# Altium schematic sheet 09_Display_Leds-2.SchDoc
size 558 x 431 mm
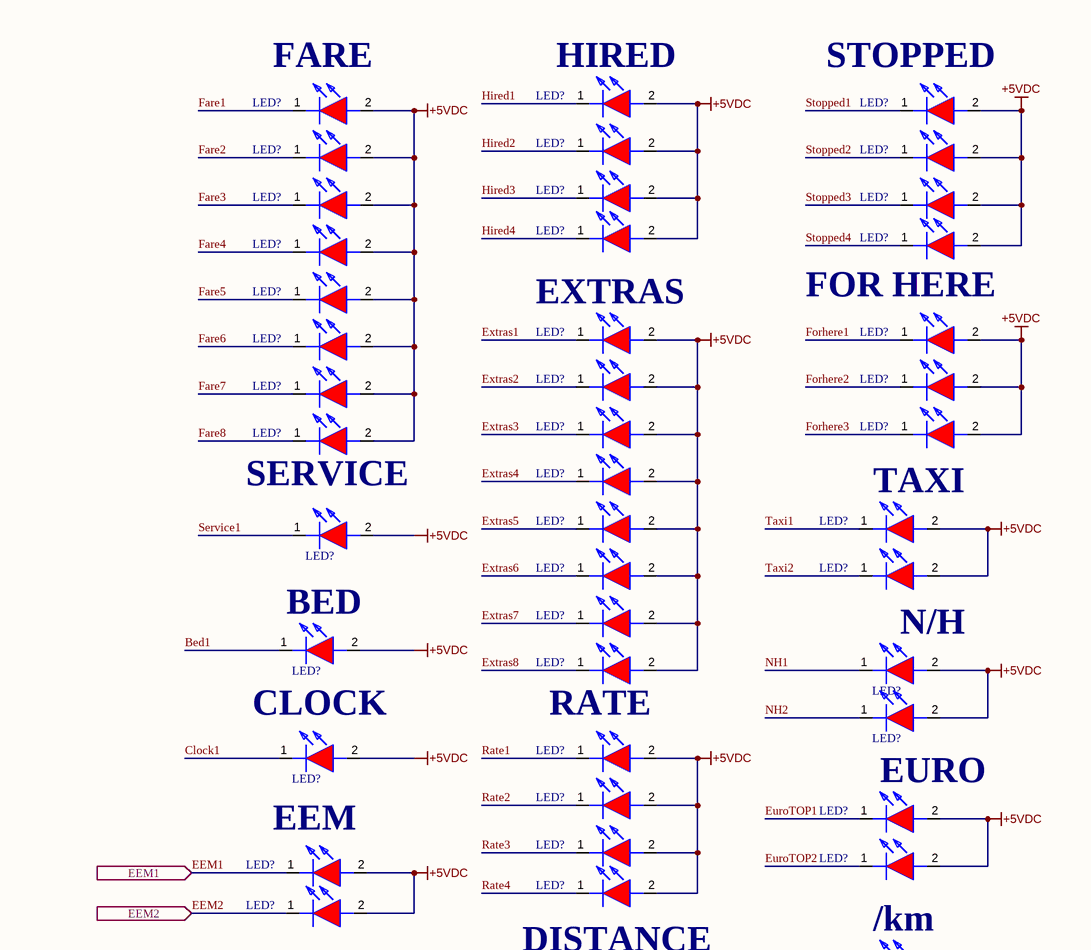
[diagram p0: 09_Display_Leds-2.SchDoc, top right]
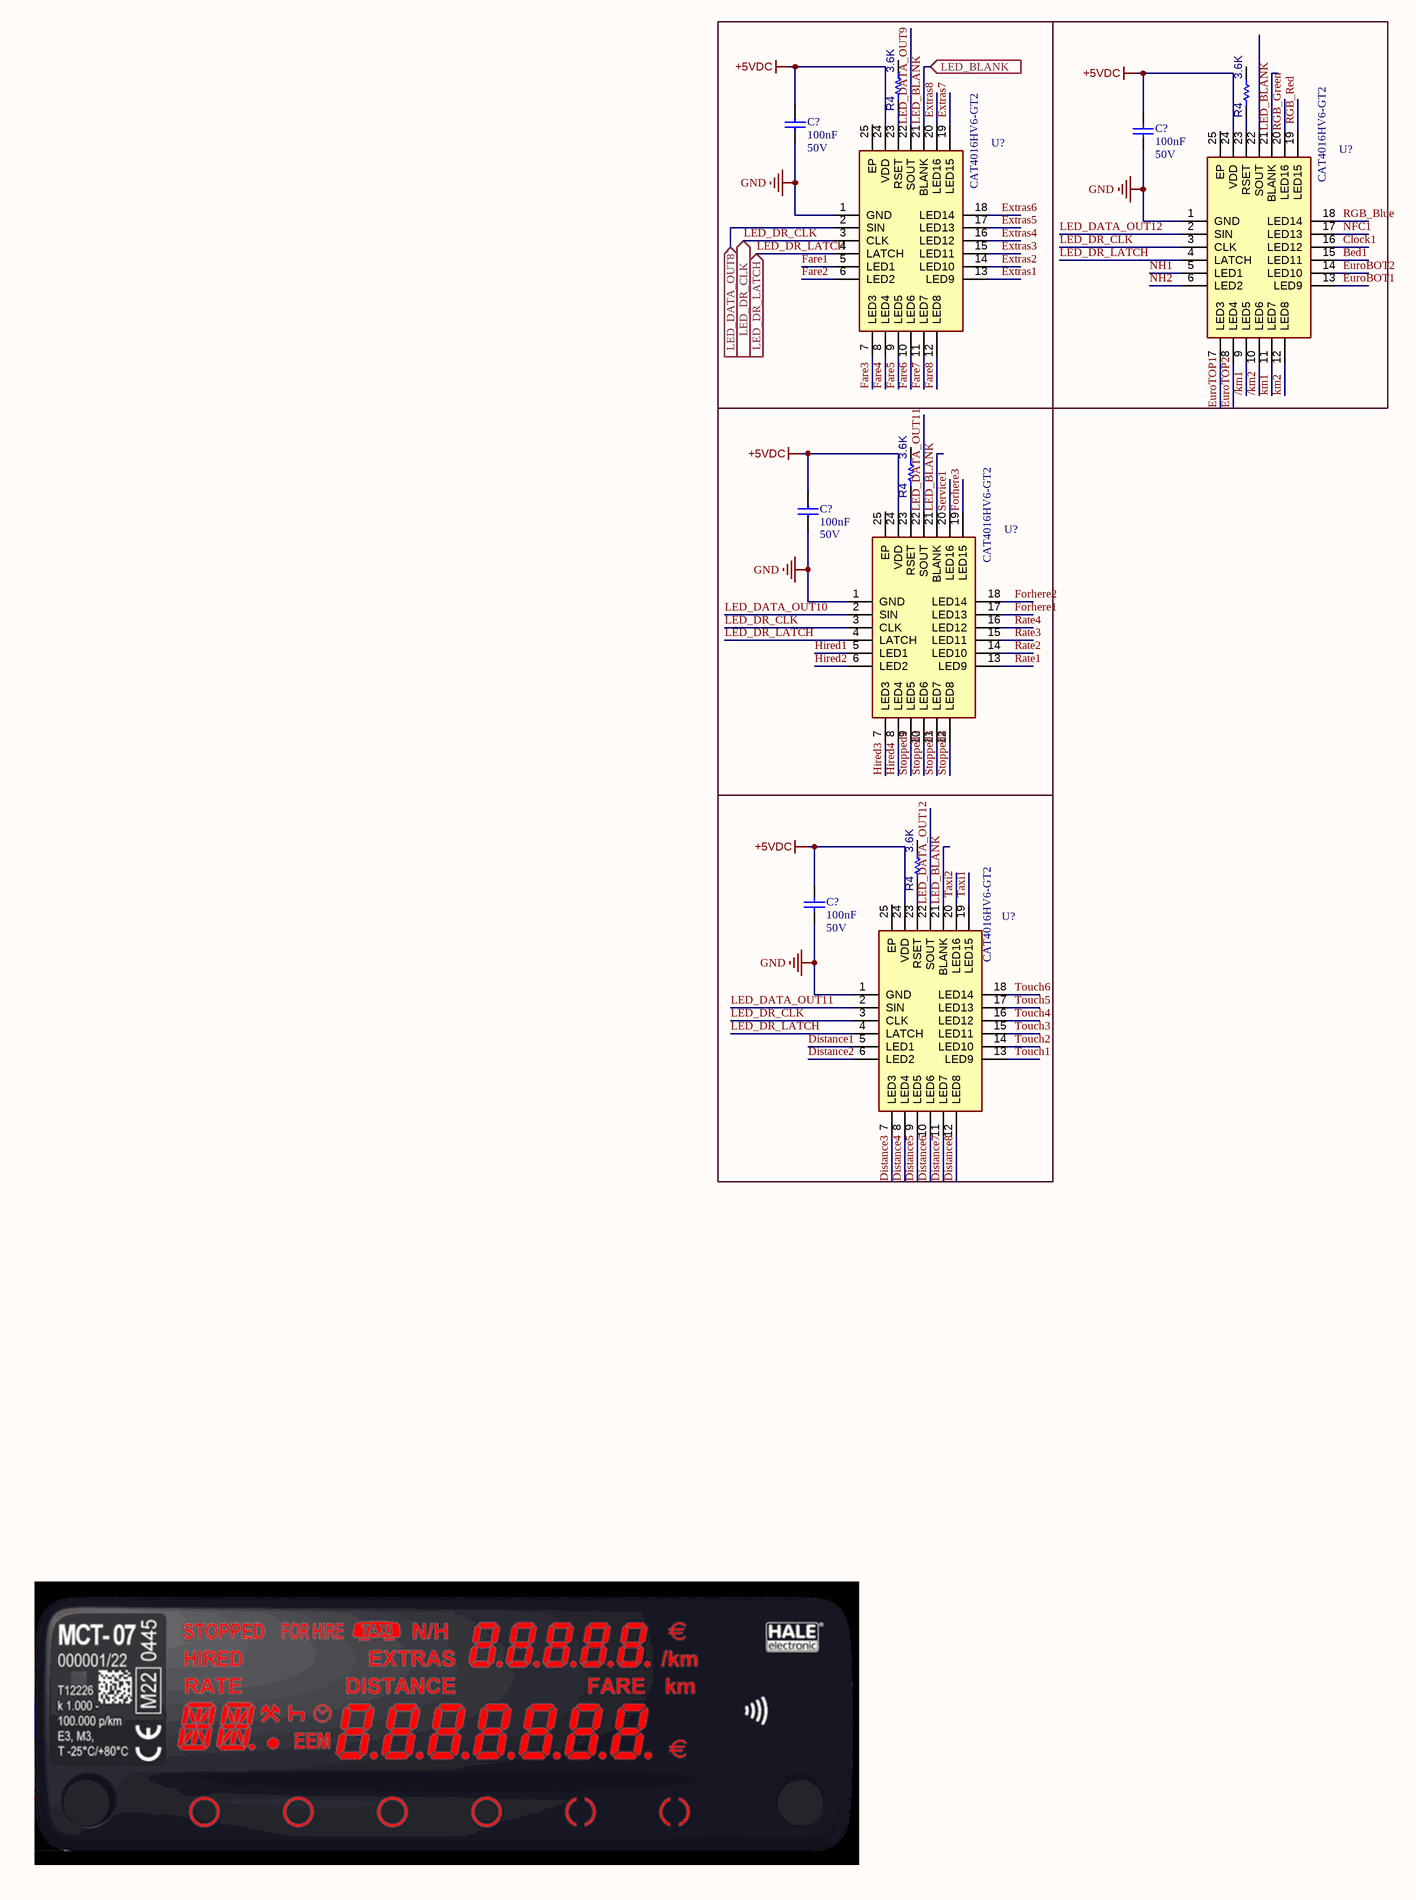
[diagram p1: 09_Display_Leds-2.SchDoc, bottom left]
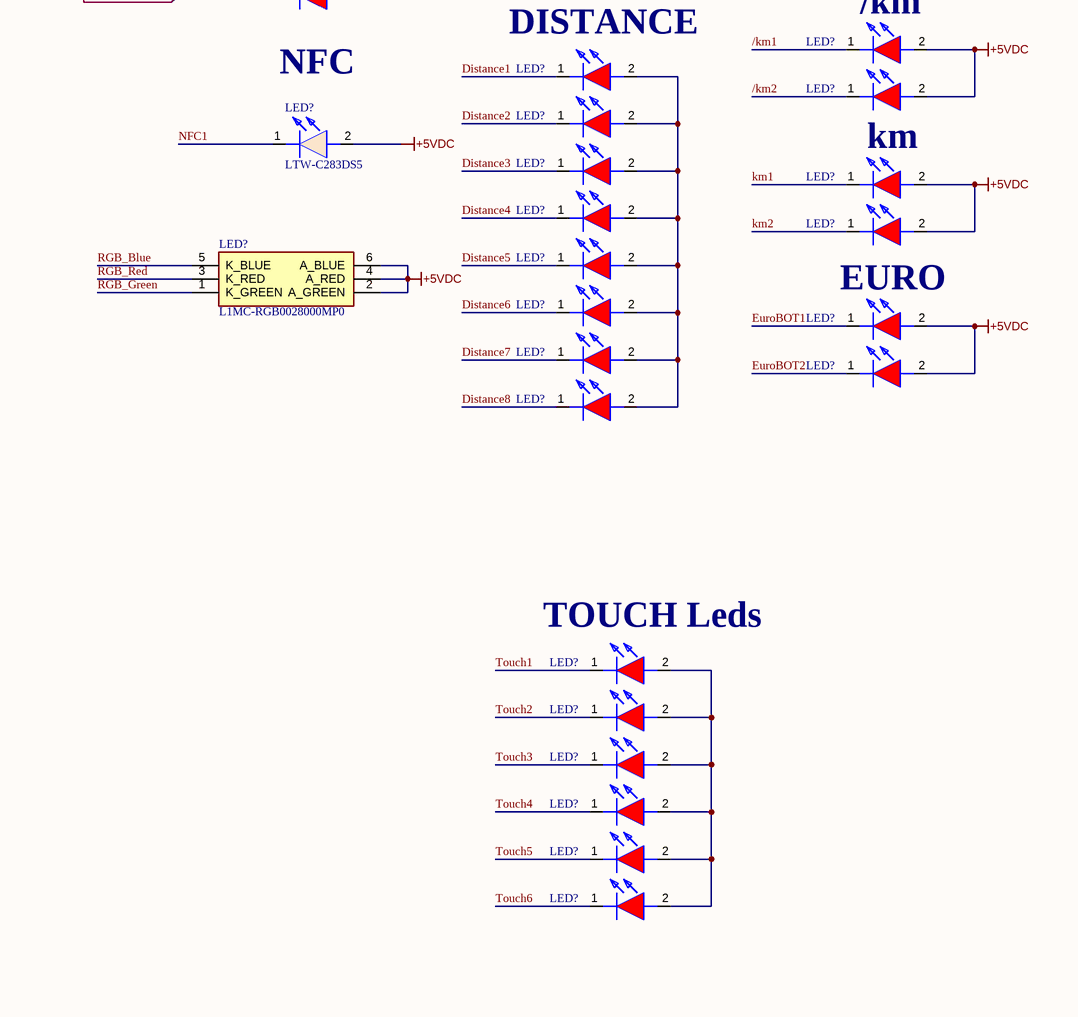
[diagram p2: 09_Display_Leds-2.SchDoc, bottom right]

## Parts
(Parts that share a designator on the sheet are numbered #1, #2 ... from top to bottom, then left to right.)
C?#1  value 100nF  Voltage: 50V  [CAP_0603]  (hidden comment: CAP)
C?#2  value 100nF  Voltage: 50V  [CAP_0603]  (hidden comment: CAP)
C?#3  value 100nF  Voltage: 50V  [CAP_0603]  (hidden comment: CAP)
C?#4  value 100nF  Voltage: 50V  [CAP_0603]  (hidden comment: CAP)
LED?#1  YLED0402R  [APHHS1005LSECKJ3PF]  (value not drawn)
LED?#2  YLED0402R  [APHHS1005LSECKJ3PF]  (value not drawn)
LED?#3  YLED0402R  [APHHS1005LSECKJ3PF]  (value not drawn)
LED?#4  YLED0402R  [APHHS1005LSECKJ3PF]  (value not drawn)
LED?#5  YLED0402R  [APHHS1005LSECKJ3PF]  (value not drawn)
LED?#6  YLED0402R  [APHHS1005LSECKJ3PF]  (value not drawn)
LED?#7  YLED0402R  [APHHS1005LSECKJ3PF]  (value not drawn)
LED?#8  YLED0402R  [APHHS1005LSECKJ3PF]  (value not drawn)
LED?#9  YLED0402R  [APHHS1005LSECKJ3PF]  (value not drawn)
LED?#10  YLED0402R  [APHHS1005LSECKJ3PF]  (value not drawn)
LED?#11  YLED0402R  [APHHS1005LSECKJ3PF]  (value not drawn)
LED?#12  YLED0402R  [APHHS1005LSECKJ3PF]  (value not drawn)
LED?#13  YLED0402R  [APHHS1005LSECKJ3PF]  (value not drawn)
LED?#14  YLED0402R  [APHHS1005LSECKJ3PF]  (value not drawn)
LED?#15  YLED0402R  [APHHS1005LSECKJ3PF]  (value not drawn)
LED?#16  YLED0402R  [APHHS1005LSECKJ3PF]  (value not drawn)
LED?#17  YLED0402R  [APHHS1005LSECKJ3PF]  (value not drawn)
LED?#18  YLED0402R  [APHHS1005LSECKJ3PF]  (value not drawn)
LED?#19  YLED0402R  [APHHS1005LSECKJ3PF]  (value not drawn)
LED?#20  YLED0402R  [APHHS1005LSECKJ3PF]  (value not drawn)
LED?#21  YLED0402R  [APHHS1005LSECKJ3PF]  (value not drawn)
LED?#22  YLED0402R  [APHHS1005LSECKJ3PF]  (value not drawn)
LED?#23  YLED0402R  [APHHS1005LSECKJ3PF]  (value not drawn)
LED?#24  YLED0402R  [APHHS1005LSECKJ3PF]  (value not drawn)
LED?#25  YLED0402R  [APHHS1005LSECKJ3PF]  (value not drawn)
LED?#26  YLED0402R  [APHHS1005LSECKJ3PF]  (value not drawn)
LED?#27  YLED0402R  [APHHS1005LSECKJ3PF]  (value not drawn)
LED?#28  YLED0402R  [APHHS1005LSECKJ3PF]  (value not drawn)
LED?#29  YLED0402R  [APHHS1005LSECKJ3PF]  (value not drawn)
LED?#30  YLED0402R  [APHHS1005LSECKJ3PF]  (value not drawn)
LED?#31  YLED0402R  [APHHS1005LSECKJ3PF]  (value not drawn)
LED?#32  YLED0402R  [APHHS1005LSECKJ3PF]  (value not drawn)
LED?#33  YLED0402R  [APHHS1005LSECKJ3PF]  (value not drawn)
LED?#34  YLED0402R  [APHHS1005LSECKJ3PF]  (value not drawn)
LED?#35  YLED0402R  [APHHS1005LSECKJ3PF]  (value not drawn)
LED?#36  YLED0402R  [APHHS1005LSECKJ3PF]  (value not drawn)
LED?#37  YLED0402R  [APHHS1005LSECKJ3PF]  (value not drawn)
LED?#38  YLED0402R  [APHHS1005LSECKJ3PF]  (value not drawn)
LED?#39  YLED0402R  [APHHS1005LSECKJ3PF]  (value not drawn)
LED?#40  YLED0402R  [APHHS1005LSECKJ3PF]  (value not drawn)
LED?#41  YLED0402R  [APHHS1005LSECKJ3PF]  (value not drawn)
LED?#42  YLED0402R  [APHHS1005LSECKJ3PF]  (value not drawn)
LED?#43  YLED0402R  [APHHS1005LSECKJ3PF]  (value not drawn)
LED?#44  YLED0402R  [APHHS1005LSECKJ3PF]  (value not drawn)
LED?#45  YLED0402R  [APHHS1005LSECKJ3PF]  (value not drawn)
LED?#46  YLED0402R  [APHHS1005LSECKJ3PF]  (value not drawn)
LED?#47  LTW-C283DS5  [APHHS1005LSECKJ3PF]
LED?#48  YLED0402R  [APHHS1005LSECKJ3PF]  (value not drawn)
LED?#49  YLED0402R  [APHHS1005LSECKJ3PF]  (value not drawn)
LED?#50  YLED0402R  [APHHS1005LSECKJ3PF]  (value not drawn)
LED?#51  YLED0402R  [APHHS1005LSECKJ3PF]  (value not drawn)
LED?#52  L1MC-RGB0028000MP0  [L1MCRGB0028000MP0]
LED?#53  YLED0402R  [APHHS1005LSECKJ3PF]  (value not drawn)
LED?#54  YLED0402R  [APHHS1005LSECKJ3PF]  (value not drawn)
LED?#55  YLED0402R  [APHHS1005LSECKJ3PF]  (value not drawn)
LED?#56  YLED0402R  [APHHS1005LSECKJ3PF]  (value not drawn)
LED?#57  YLED0402R  [APHHS1005LSECKJ3PF]  (value not drawn)
LED?#58  YLED0402R  [APHHS1005LSECKJ3PF]  (value not drawn)
LED?#59  YLED0402R  [APHHS1005LSECKJ3PF]  (value not drawn)
LED?#60  YLED0402R  [APHHS1005LSECKJ3PF]  (value not drawn)
LED?#61  YLED0402R  [APHHS1005LSECKJ3PF]  (value not drawn)
LED?#62  YLED0402R  [APHHS1005LSECKJ3PF]  (value not drawn)
LED?#63  YLED0402R  [APHHS1005LSECKJ3PF]  (value not drawn)
LED?#64  YLED0402R  [APHHS1005LSECKJ3PF]  (value not drawn)
R4#1  value 3.6K  [RES_0603]  (hidden comment: RC0603FR-133K6L)
R4#2  value 3.6K  [RES_0603]  (hidden comment: RC0603FR-133K6L)
R4#3  value 3.6K  [RES_0603]  (hidden comment: RC0603FR-133K6L)
R4#4  value 3.6K  [RES_0603]  (hidden comment: RC0603FR-133K6L)
U?#1  CAT4016HV6-GT2  [QFN50P400X400X80-25N-D]
U?#2  CAT4016HV6-GT2  [QFN50P400X400X80-25N-D]
U?#3  CAT4016HV6-GT2  [QFN50P400X400X80-25N-D]
U?#4  CAT4016HV6-GT2  [QFN50P400X400X80-25N-D]

## Ports
EEM1 (in), EEM2 (in), LED_BLANK (in), LED_DATA_OUT8 (in), LED_DR_CLK (in), LED_DR_LATCH (in)

## Nets
+5VDC: C?#1.1 C?#2.1 C?#3.1 C?#4.1 LED?#1.2(A) LED?#2.2(A) LED?#3.2(A) LED?#4.2(A) LED?#5.2(A) LED?#6.2(A) LED?#7.2(A) LED?#8.2(A) LED?#9.2(A) LED?#10.2(A) LED?#11.2(A) LED?#12.2(A) LED?#13.2(A) LED?#14.2(A) LED?#15.2(A) LED?#16.2(A) LED?#17.2(A) LED?#18.2(A) LED?#19.2(A) LED?#20.2(A) LED?#21.2(A) LED?#22.2(A) LED?#23.2(A) LED?#24.2(A) LED?#25.2(A) LED?#26.2(A) LED?#27.2(A) LED?#28.2(A) LED?#29.2(A) LED?#30.2(A) LED?#31.2(A) LED?#32.2(A) LED?#33.2(A) LED?#34.2(A) LED?#35.2(A) LED?#36.2(A) LED?#37.2(A) LED?#38.2(A) LED?#39.2(A) LED?#40.2(A) LED?#41.2(A) LED?#42.2(A) LED?#43.2(A) LED?#45.2(A) LED?#47.2(A) LED?#49.2(A) LED?#51.2(A) LED?#52.2(A_GREEN) LED?#52.4(A_RED) LED?#52.6(A_BLUE) LED?#55.2(A) LED?#57.2(A) U?#1.24(VDD) U?#2.24(VDD) U?#3.24(VDD) U?#4.24(VDD)
GND: C?#1.2 C?#2.2 C?#3.2 C?#4.2 U?#1.1(GND) U?#2.1(GND) U?#3.1(GND) U?#4.1(GND)
/km1: LED?#43.1(K) U?#2.9(LED5)
/km2: LED?#45.1(K) U?#2.10(LED6)
Bed1: LED?#30.1(K) U?#2.15(LED11)
Clock1: LED?#34.1(K) U?#2.16(LED12)
Distance1: LED?#44.1(K) U?#4.5(LED1)
Distance2: LED?#46.1(K) U?#4.6(LED2)
Distance3: LED?#48.1(K) U?#4.7(LED3)
Distance4: LED?#50.1(K) U?#4.8(LED4)
Distance5: LED?#53.1(K) U?#4.9(LED5)
Distance6: LED?#54.1(K) U?#4.10(LED6)
Distance7: LED?#56.1(K) U?#4.11(LED7)
Distance8: LED?#58.1(K) U?#4.12(LED8)
EEM1: LED?#40.1(K) ; port EEM1
EEM2: LED?#42.1(K) ; port EEM2
EuroBOT1: LED?#55.1(K) U?#2.13(LED9)
EuroBOT2: LED?#57.1(K) U?#2.14(LED10)
EuroTOP1: LED?#37.1(K) U?#2.7(LED3)
EuroTOP2: LED?#39.1(K) U?#2.8(LED4)
Extras1: LED?#14.1(K) U?#1.13(LED9)
Extras2: LED?#17.1(K) U?#1.14(LED10)
Extras3: LED?#20.1(K) U?#1.15(LED11)
Extras4: LED?#23.1(K) U?#1.16(LED12)
Extras5: LED?#24.1(K) U?#1.17(LED13)
Extras6: LED?#27.1(K) U?#1.18(LED14)
Extras7: LED?#29.1(K) U?#1.19(LED15)
Extras8: LED?#31.1(K) U?#1.20(LED16)
Fare1: LED?#2.1(K) U?#1.5(LED1)
Fare2: LED?#5.1(K) U?#1.6(LED2)
Fare3: LED?#8.1(K) U?#1.7(LED3)
Fare4: LED?#12.1(K) U?#1.8(LED4)
Fare5: LED?#13.1(K) U?#1.9(LED5)
Fare6: LED?#16.1(K) U?#1.10(LED6)
Fare7: LED?#19.1(K) U?#1.11(LED7)
Fare8: LED?#22.1(K) U?#1.12(LED8)
Forhere1: LED?#15.1(K) U?#3.17(LED13)
Forhere2: LED?#18.1(K) U?#3.18(LED14)
Forhere3: LED?#21.1(K) U?#3.19(LED15)
Hired1: LED?#1.1(K) U?#3.5(LED1)
Hired2: LED?#4.1(K) U?#3.6(LED2)
Hired3: LED?#7.1(K) U?#3.7(LED3)
Hired4: LED?#10.1(K) U?#3.8(LED4)
km1: LED?#49.1(K) U?#2.11(LED7)
km2: LED?#51.1(K) U?#2.12(LED8)
LED_BLANK: U?#1.21(BLANK) U?#2.21(BLANK) U?#3.21(BLANK) U?#4.21(BLANK) ; port LED_BLANK
LED_DATA_OUT8: U?#1.2(SIN) ; port LED_DATA_OUT8
LED_DATA_OUT9: U?#1.22(SOUT)
LED_DATA_OUT10: U?#3.2(SIN)
LED_DATA_OUT11: U?#3.22(SOUT) U?#4.2(SIN)
LED_DATA_OUT12: U?#2.2(SIN) U?#4.22(SOUT)
LED_DR_CLK: U?#1.3(CLK) U?#2.3(CLK) U?#3.3(CLK) U?#4.3(CLK) ; port LED_DR_CLK
LED_DR_LATCH: U?#1.4(LATCH) U?#2.4(LATCH) U?#3.4(LATCH) U?#4.4(LATCH) ; port LED_DR_LATCH
NFC1: LED?#47.1(K) U?#2.17(LED13)
NH1: LED?#32.1(K) U?#2.5(LED1)
NH2: LED?#33.1(K) U?#2.6(LED2)
Rate1: LED?#35.1(K) U?#3.13(LED9)
Rate2: LED?#36.1(K) U?#3.14(LED10)
Rate3: LED?#38.1(K) U?#3.15(LED11)
Rate4: LED?#41.1(K) U?#3.16(LED12)
RGB_Blue: LED?#52.5(K_BLUE) U?#2.18(LED14)
RGB_Green: LED?#52.1(K_GREEN) U?#2.20(LED16)
RGB_Red: LED?#52.3(K_RED) U?#2.19(LED15)
Service1: LED?#26.1(K) U?#3.20(LED16)
Stopped1: LED?#3.1(K) U?#3.9(LED5)
Stopped2: LED?#6.1(K) U?#3.10(LED6)
Stopped3: LED?#9.1(K) U?#3.11(LED7)
Stopped4: LED?#11.1(K) U?#3.12(LED8)
Taxi1: LED?#25.1(K) U?#4.19(LED15)
Taxi2: LED?#28.1(K) U?#4.20(LED16)
Touch1: LED?#59.1(K) U?#4.13(LED9)
Touch2: LED?#60.1(K) U?#4.14(LED10)
Touch3: LED?#61.1(K) U?#4.15(LED11)
Touch4: LED?#62.1(K) U?#4.16(LED12)
Touch5: LED?#63.1(K) U?#4.17(LED13)
Touch6: LED?#64.1(K) U?#4.18(LED14)
NetLED?#44_2: LED?#44.2(A) LED?#46.2(A) LED?#48.2(A) LED?#50.2(A) LED?#53.2(A) LED?#54.2(A) LED?#56.2(A) LED?#58.2(A)
NetLED?#59_2: LED?#59.2(A) LED?#60.2(A) LED?#61.2(A) LED?#62.2(A) LED?#63.2(A) LED?#64.2(A)
NetR4#1_1: R4#1.1 U?#1.23(RSET)
NetR4#2_1: R4#2.1 U?#2.23(RSET)
NetR4#3_1: R4#3.1 U?#3.23(RSET)
NetR4#4_1: R4#4.1 U?#4.23(RSET)

Not connected (* = marked no-connect by the designer): R4#1 2; R4#2 2; R4#3 2; R4#4 2; U?#1 25(EP); U?#2 22(SOUT) 25(EP); U?#3 25(EP); U?#4 25(EP)

## Notes on the sheet
- (near LED?#2) FARE
- (near LED?#1) HIRED
- (near LED?#3) STOPPED
- (near LED?#14) EXTRAS
- (near LED?#11) FOR HERE
- (near LED?#22) SERVICE
- (near LED?#21) TAXI
- (near LED?#30) BED
- (near LED?#28) N/H
- (near LED?#30) CLOCK
- (near LED?#31) RATE
- (near LED?#37) EURO
- (near LED?#40) EEM
- (near LED?#42) NFC
- (near LED?#41) DISTANCE
- (near LED?#43) /km
- (near LED?#45) km
- (near LED?#51) EURO
- (near LED?#59) TOUCH Leds
- DWG. NO.
- REV.
- SHT.
- REVISION
- DESCRIPTION
- DATE
- APPROVED
- THIS DOCUMENT AND THE DATA DISCLOSED HEREIN OR HEREWITH IS THE PROPERTY OF ALTIUM LIMITED AND MAY BE FREELY DISTRIBUTED IN WHOLE. NO RIGHTS ARE RESERVED OR EXPRESS OR IMPLIED WARANTEE GIVEN.
- ENG:
- DSN:
- APPROVALS
- PROJECT
- DOCUMENT REVISION:
- DESIGN ITEM:
- CHK:
- BOM:
- REFERENCE DOCUMENTS
- PROJECT REVISION:
- TITLE
- FAB DWG:
- PCB DWG:
- ASSY DWG:
- SCALE:
- SIZE
- C
- CAGE CODE
- FILE NAME
- DWG NO.
- SHEET
- OF
- REV

## Library data of the parts
C?#1-C?#4 = C01763: CAP CER 100nF 50VDC %10 X7R SMD; Manufacturer: Samsung; Manufacturer Part Number: CL10B104KB8NNNL
LED?#1-LED?#46 LED?#48-LED?#51 LED?#53-LED?#64 = YLED0402R: LED RED WATER CLEAR 0402 SMD; Manufacturer: Kingbright; Value: 0402; Manufacturer Part Number: YLED0402R
LED?#47 = LTW-C283DS5: LED WHITE YELLOW LENS 0402 SMD; Manufacturer: LITEON; Value: 0402; Manufacturer Part Number: LTW-C283DS5
LED?#52 = L1MC-RGB0028000MP0: LED; Manufacturer_Name: Lumileds; Datasheet Link: https://lumileds.com/wp-content/uploads/2022/03/DS388-luxeon-3528-rgb-datasheet.pdf; Height: 1.85mm; Manufacturer_Part_Number: L1MC-RGB0028000MP0; Mouser Part Number: 997-L1MCRGB00280MP; Mouser Price/Stock: https://www.mouser.co.uk/ProductDetail/Lumileds/L1MC-RGB0028000MP0?qs=Znm5pLBrcAJSGF05jr80lQ%3D%3D; Arrow Part Number: L1MC-RGB0028000MP0; Arrow Price/Stock: https://www.arrow.com/en/products/l1mc-rgb0028000mp0/lumileds.html?utm_currency=USD&region=nac
R4#1-R4#4 = 0603SAF3301T5E: RES.(1608) 0603 3.6K Ohms 1% 1/10W 100PPM SMT; Manufacturer: YAGEO; Manufacturer Part Number: RC0603FR-133K6L
U?#1-U?#4 = CAT4016HV6-GT2: Integrated Circuit; Manufacturer_Name: onsemi; Datasheet Link: https://www.onsemi.com/download/data-sheet/pdf/cat4016-d.pdf; Height: 0.8mm; Manufacturer_Part_Number: CAT4016HV6-GT2; Mouser Part Number: 698-CAT4016HV6-GT2; Mouser Price/Stock: https://www.mouser.co.uk/ProductDetail/onsemi/CAT4016HV6-GT2?qs=rZgeL6XvLwaPp0eUTTX%2FiA%3D%3D; Arrow Part Number: CAT4016HV6-GT2; Arrow Price/Stock: https://www.arrow.com/en/products/cat4016hv6-gt2/on-semiconductor